# Altium schematic sheet CONN.SchDoc: CONNECTIONS
size A4; DocumentNumber: 14; Revision: 2.0; SheetNumber: 14; SheetTotal: 18
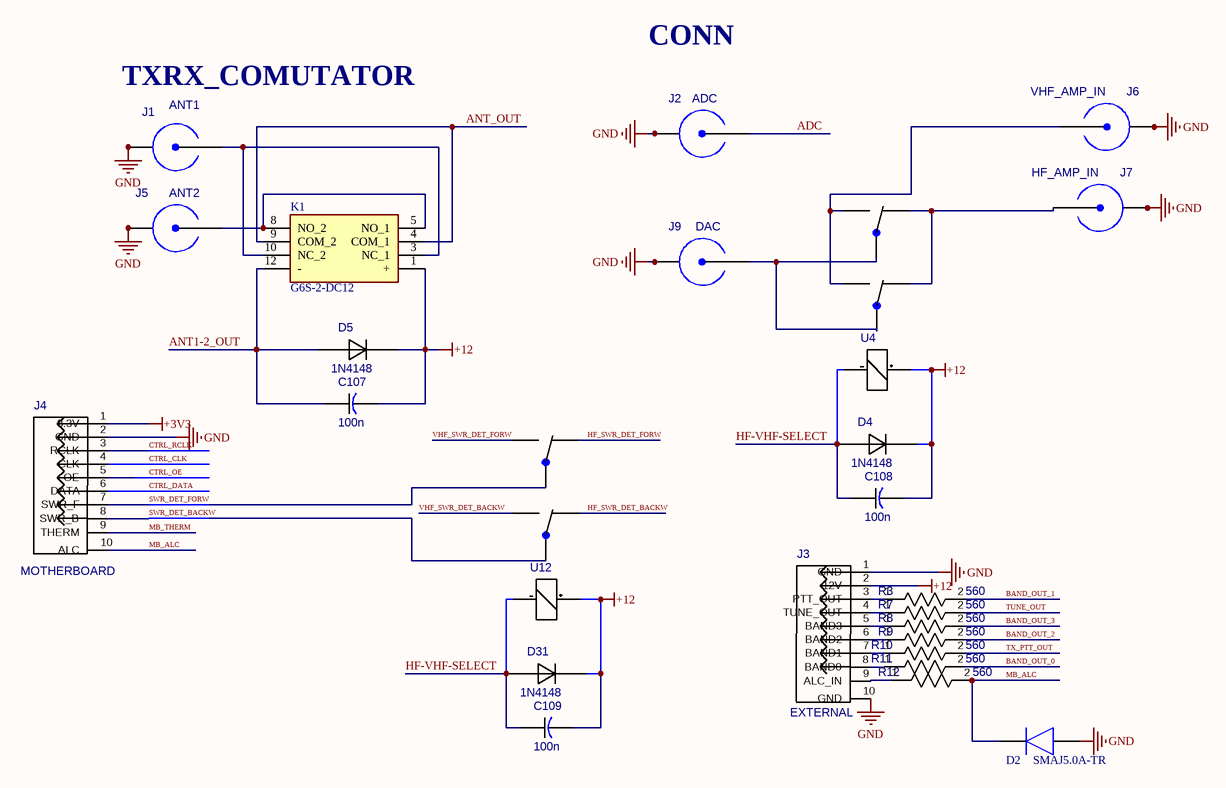
[diagram p0: CONN.SchDoc]

## Parts
C107  100n  [CAP_0805]
C108  100n  [CAP_0805]
C109  100n  [CAP_0805]
D2  SMAJ5.0A-TR  [SMBJ36CATR]
D4  1N4148  [SS14]
D5  1N4148  [SS14]
D31  1N4148  [SS14]
J1  ANT1  [31-5431]
J2  ADC  [31-5431]
J3  EXTERNAL  [90131-0126]
J4  MOTHERBOARD  [90131-0126]
J5  ANT2  [31-5431]
J6  VHF_AMP_IN  [31-5431]
J7  HF_AMP_IN  [31-5431]
J9  DAC  [31-5431]
K1  G6S-2-DC12  [G6S2DC12]
R3  560  [RES_0805]
R7  560  [RES_0805]
R8  560  [RES_0805]
R9  560  [RES_0805]
R10  560  [RES_0805]
R11  560  [RES_0805]
R12  560  [RES_0805]
U4  Axicom IM06  [IM06GR]  (value not drawn)
U12  Axicom IM06  [IM06GR]  (value not drawn)

## Nets
+3V3: J4.1(3.3V)
+12: C107.2 C108.2 C109.2 D4.1(K) D5.1(K) D31.1(K) J3.2(12V) K1.1(+) U4.1(+) U12.1(+)
GND: D2.2(A) J1.1(GND) J1.2(GND) J1.3(GND) J1.4(GND) J2.1(GND) J2.2(GND) J2.3(GND) J2.4(GND) J3.1(GND) J3.10(GND) J4.2(GND) J5.1(GND) J5.2(GND) J5.3(GND) J5.4(GND) J6.1(GND) J6.2(GND) J6.3(GND) J6.4(GND) J7.1(GND) J7.2(GND) J7.3(GND) J7.4(GND) J9.1(GND) J9.2(GND) J9.3(GND) J9.4(GND)
ADC: J2.5(CON)
ANT1-2_OUT: C107.1 D5.2(A) K1.12(-)
ANT_OUT: K1.4(COM_1) K1.9(COM_2)
BAND_OUT_0: R11.2
BAND_OUT_1: R3.2
BAND_OUT_2: R9.2
BAND_OUT_3: R8.2
CTRL_CLK: J4.4(CLK)
CTRL_DATA: J4.6(DATA)
CTRL_OE: J4.5(OE)
CTRL_RCLK: J4.3(RCLK)
HF-VHF-SELECT: C108.1 C109.1 D4.2(A) D31.2(A) U4.8(-) U12.8(-)
HF_SWR_DET_BACKW: U12.2(O)
HF_SWR_DET_FORW: U12.7(O)
MB_ALC: D2.1(K) J4.10(ALC) R12.2
MB_THERM: J4.9(THERM)
SWR_DET_BACKW: J4.8(SWR_B) U12.3(P)
SWR_DET_FORW: J4.7(SWR_F) U12.6(P)
TUNE_OUT: R7.2
TX_PTT_OUT: R10.2
VHF_SWR_DET_BACKW: U12.4(S)
VHF_SWR_DET_FORW: U12.5(S)
NetJ1_5: J1.5(CON) K1.3(NC_1) K1.10(NC_2)
NetJ3_3: J3.3(PTT_OUT) R3.1
NetJ3_4: J3.4(TUNE_OUT) R7.1
NetJ3_5: J3.5(BAND3) R8.1
NetJ3_6: J3.6(BAND2) R9.1
NetJ3_7: J3.7(BAND1) R10.1
NetJ3_8: J3.8(BAND0) R11.1
NetJ3_9: J3.9(ALC_IN) R12.1
NetJ5_5: J5.5(CON) K1.5(NO_1) K1.8(NO_2)
NetJ6_5: J6.5(CON) U4.4(S) U4.5(S)
NetJ7_5: J7.5(CON) U4.2(O) U4.7(O)
NetJ9_5: J9.5(CON) U4.3(P) U4.6(P)

## Notes on the sheet
- CONN
- TXRX_COMUTATOR
- Title
- Size:
- Date:
- A4
- Number:
- Time:
- Revision:
- Sheet
- of
- File:

## Library data of the parts
C107-C109 = CAP_0805
D2 = SMLVT3V3: Diode; Manufacturer_Name: STMicroelectronics; Allied_Number: 70013736; Datasheet Link: http://www.st.com/web/en/resource/technical/document/datasheet/CD00000923.pdf; Height: 2.65mm; Manufacturer_Part_Number: SMLVT3V3; Mouser Part Number: 511-SMLVT3V3; Mouser Price/Stock: https://www.mouser.com/Search/Refine.aspx?Keyword=511-SMLVT3V3; RS Part Number: 5444821P; RS Price/Stock: http://uk.rs-online.com/web/p/products/5444821P; Allied Price/Stock: http://www.alliedelec.com/stmicroelectronics-smlvt3v3/70013736/
J1 J2 J5-J7 J9 = 31-5431: SMA
  J2: Value: ADC
  J9: Value: DAC
J3 J4 = 90131-0126: 2*5 PIN; Value: *
K1 = G6S-2-DC12: Relay or Contactor; Manufacturer_Name: Omron Electronics; Datasheet Link: https://componentsearchengine.com/Datasheets/1/G6S-2-DC12.pdf; Height: 9.4mm; Manufacturer_Part_Number: G6S-2-DC12; Mouser Part Number: 653-G6S-2-DC12A; Mouser Price/Stock: https://www.mouser.co.uk/ProductDetail/Omron-Electronics/G6S-2-DC12/?qs=QGk6feVlqMLN9Ouv0QsFzA%3D%3D
R3 R7-R12 = RES_0805: Value: 560
D4 D5 D31 = 1N4148: Value: *
U4 U12 = Axicom IM06: Value: *